# EAGLE design tank_interface (EAGLE 7.2.0)
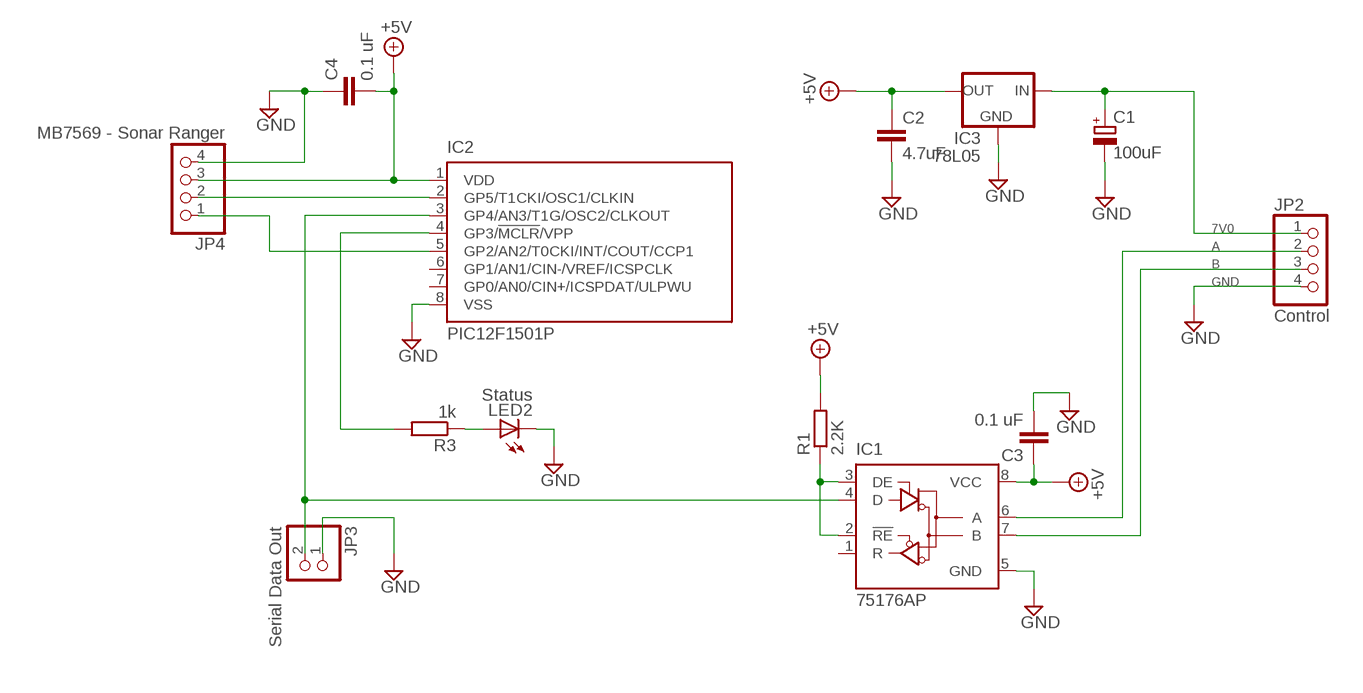
[diagram p0: schematic, sheet 1]

## Parts
C1  100uF  CPOL-EUE2.5-7  [E2,5-7]
C2  4.7uF  C-EUC0402  [C0402]
C3  0.1 uF  C-EUC0402  [C0402]
C4  0.1 uF  C-EUC0402  [C0402]
IC1  75176AP  [DIL08]
IC2  PIC12F1501P  PIC12F683P  [DIL8]
IC3  78L05  78XXS  [78XXS]
JP2  Control  PINHD-1X4  [1X04]
JP3  Serial Data Out  PINHD-1X2  [1X02]
JP4  MB7569 - Sonar Ranger  PINHD-1X4  [1X04]
LED2  Status  LED3MM  [LED3MM]
R1  2.2K  R-EU_R0603  [R0603]
R3  1k  R-EU_R0603  [R0603]

## Nets
7V0: C1.+ IC3.IN JP2.1
+5V: C2.1 C3.1 C4.2 IC1.8(VCC) IC2.1(VDD) IC3.OUT JP4.3 R1.2
A: IC1.6(A) JP2.2
B: IC1.7(B) JP2.3
DE: IC1.2(!RE) IC1.3(DE) R1.1
GND: C1.- C2.2 C3.2 C4.1 IC1.5(GND) IC2.8(VSS) IC3.GND JP2.4 JP3.1 JP4.4 LED2.K(C)
N$1: IC2.5(GP2/AN2/T0CKI/INT/COUT/CCP1) JP4.1
N$5: LED2.A R3.1
SDAT_IN: IC2.2(GP5/T1CKI/OSC1/CLKIN) JP4.2
SDAT_OUT: IC1.4(D) IC2.3(GP4/AN3/T1G/OSC2/CLKOUT) JP3.2
STATUS_LED: IC2.4(GP3/!MCLR!/VPP) R3.2
Unconnected: IC1.1(R) IC2.6(GP1/AN1/CIN-/VREF/ICSPCLK) IC2.7(GP0/AN0/CIN+/ICSPDAT/ULPWU)

## Library data of the parts
C1 = rcl:CPOL-EU: POLARIZED CAPACITOR, European symbol
C2-C4 = rcl:C-EU: CAPACITOR, European symbol
IC1 = 751xx:75176A: DIFFERENTIAL BUS TRANSCEIVER Source: http://focus.ti.com/lit/ds/symlink/sn75176a.pdf
IC2 = microchip:PIC12F683: 8-Pin Flash-Based, 8-Bit CMOS Microcontrollers with nanoWatt Technology Source: http://ww1.microchip.com/downloads/en/DeviceDoc/41211D_.pdf; MF: MICROCHIP; MPN: PIC12F683-I/P; OC_FARNELL: 9759034; OC_NEWARK: 89H0442
IC3 = v-reg:78XXS: VOLTAGE REGULATOR
JP2 JP4 = pinhead:PINHD-1X4: PIN HEADER
JP3 = pinhead:PINHD-1X2: PIN HEADER
LED2 = led:LED: LED OSRAM: - CHIPLED LG R971, LG N971, LY N971, LG Q971, LY Q971, LO R971, LY R971 LH N974, LH R974 LS Q976, LO Q976, LY Q976 LO Q996 - Hyper CHIPLED LW Q18S LB Q993, LB Q99A, LB R99A - SideLED LS A670, LO A670, LY A670, LG A670, LP A670 LB A673, LV A673, LT A673, LW A673 LH A674 LY A675 LS A676, LA A676, LO A676, LY A676, LW A676 LS A679, LY A679, LG A679 - Hyper Micro SIDELED® LS Y876, LA Y876, LO Y876, LY Y876 LT Y87S - SmartLED LW L88C, LW L88S LB L89C, LB L89S, LG L890 LS L89K, LO L89K, LY L89K LS L896, LA L896, LO L896, LY L896 - TOPLED LS T670, LO T670, LY T670, LG T670, LP T670 LSG T670, LSP T670, LSY T670, LOP T670, LYG T670 LG T671, LOG T671, LSG T671 LB T673, LV T673, LT T673, LW T673 LH T674 LS T676, LA T676, LO T676, LY T676, LB T676, LH T676, LSB T676, LW T676 LB T67C, LV T67C, LT T67C, LS T67K, LO T67K, LY T67K, LW E67C LS E67B, LA E67B, LO E67B, LY E67B, LB E67C, LV E67C, LT E67C LW T67C LS T679, LY T679, LG T679 LS T770, LO T770, LY T770, LG T770, LP T770 LB T773, LV T773, LT T773, LW T773 LH T774 LS E675, LA E675, LY E675, LS T675 LS T776, LA T776, LO T776, LY T776, LB T776 LHGB T686 LT T68C, LB T68C - Hyper Mini TOPLED® LB M676 - Mini TOPLED Santana® LG M470 LS M47K, LO M47K, LY M47K Source: http://www.osram.convergy.de LUXEON: - LUMILED® LXK2-PW12-R00, LXK2-PW12-S00, LXK2-PW14-U00, LXK2-PW14-V00 LXK2-PM12-R00, LXK2-PM12-S00, LXK2-PM14-U00 LXK2-PE12-Q00, LXK2-PE12-R00, LXK2-PE12-S00, LXK2-PE14-T00, LXK2-PE14-U00 LXK2-PB12-K00, LXK2-PB12-L00, LXK2-PB12-M00, LXK2-PB14-N00, LXK2-PB14-P00, LXK2-PB14-Q00 LXK2-PR12-L00, LXK2-PR12-M00, LXK2-PR14-Q00, LXK2-PR14-R00 LXK2-PD12-Q00, LXK2-PD12-R00, LXK2-PD12-S00 LXK2-PH12-R00, LXK2-PH12-S00 LXK2-PL12-P00, LXK2-PL12-Q00, LXK2-PL12-R00 Source: www.luxeon.com KINGBRIGHT: KA-3528ASYC Source: www.kingbright.com
R1 R3 = rcl:R-EU_: RESISTOR, European symbol

## Board
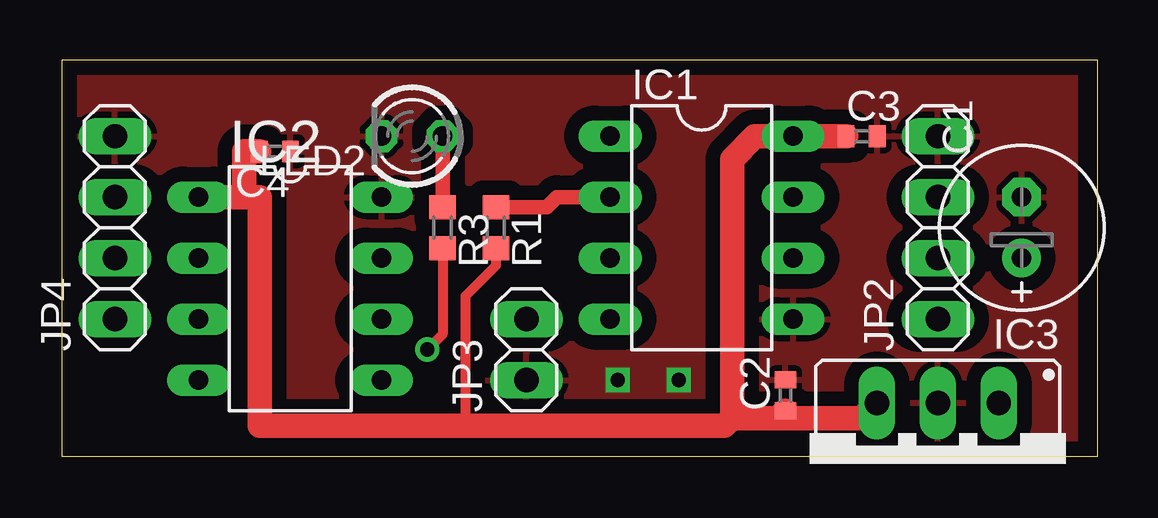
[diagram p1: board, top side]
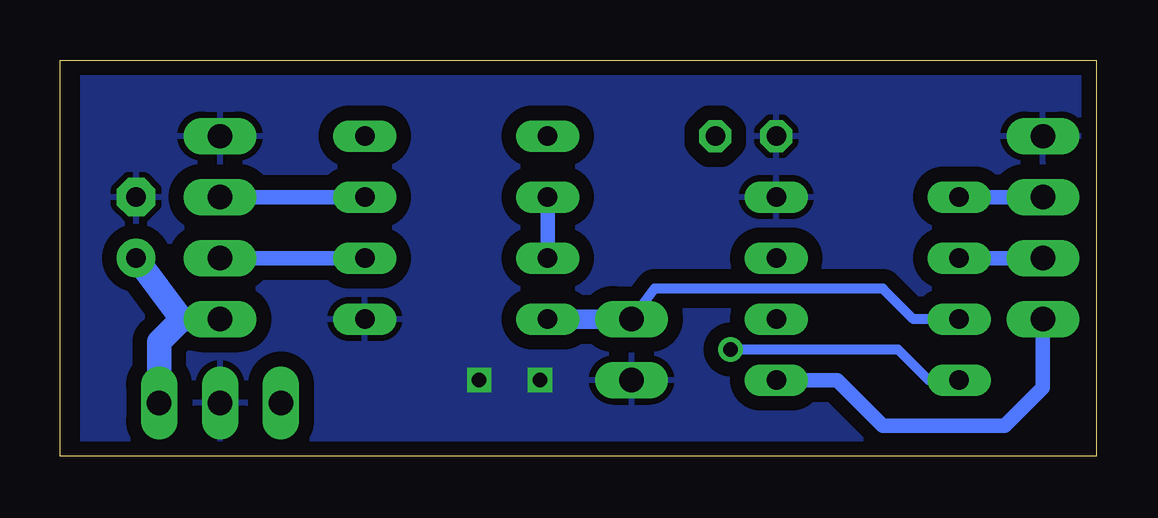
[diagram p2: board, bottom side, seen from below]

Size 43.18 x 16.51 mm. Coordinates in mm from the lower left corner, seen from the top.
Outline: 0,0 43.18,0 43.18,16.51 0,16.5 0,0
Copper layers (1*16): Top 0.035mm / dielectric 1.5mm / Bottom 0.035mm
Design rules "default *": minimum track width 10mil, minimum drill 20mil, track to track 8mil, track to pad 8mil, pad to pad 8mil, via to via 8mil, smd to smd 8mil, copper to edge 20mil, drill to drill 8mil, minimum pad ring 10mil, minimum via ring 8mil, stop-mask expansion 4mil, vias tented up to drill 0mil, thermal gap 10mil

### Footprints (pad centres in the part's own frame; a part is rotated, then mirrored left to right if it is on the bottom)
E2,5-7 = drill 0.813 pad 1.6: + -1.27,0 | drill 0.813 pad 1.6 octagon: - 1.27,0
C0402 = smd 0.7 x 0.9: 1 -0.65,0; 2 0.65,0
DIL08 = drill 0.813 long: 1 -3.81,-3.81; 2 -1.27,-3.81; 3 1.27,-3.81; 4 3.81,-3.81; 5 3.81,3.81; 6 1.27,3.81; 7 -1.27,3.81; 8 -3.81,3.81
DIL8 = drill 0.813 long: 1 -3.81,-3.81; 2 -1.27,-3.81; 3 1.27,-3.81; 4 3.81,-3.81; 5 3.81,3.81; 6 1.27,3.81; 7 -1.27,3.81; 8 -3.81,3.81
78XXS = drill 1.016 long: GND 0,-2.54; IN -2.54,-2.54; OUT 2.54,-2.54
1X04 = drill 1.016 long: 1 -3.81,0; 2 -1.27,0; 3 1.27,0; 4 3.81,0
1X02 = drill 1.016 long: 1 -1.27,0; 2 1.27,0
LED3MM = drill 0.813 octagon: A -1.27,0; K 1.27,0
R0603 = smd 1 x 1.1: 1 -0.85,0; 2 0.85,0

### Placement (x,y rotation side)
C1  40.01,9.53 90 top
C2  30.16,2.54 90 top
C3  33.34,13.34 0 top
C4  8.89,12.7 180 top
IC1  26.67,9.53 270 top
IC2  9.53,6.99 270 top
IC3  36.51,-0.32 180 top
JP2  36.51,9.53 90 top
JP3  19.37,4.45 90 top
JP4  2.22,9.53 90 top
LED2  14.61,13.34 180 top
R1  18.1,9.53 270 top
R3  15.88,9.53 270 top

### Tracks (layer width: path | path; a pad name or v marks a point on that pad's centre or on a via)
7V0
  Bottom 1.016: 38.1,5.71 JP2.1 35.56,5.71 | 38.1,5.71 C1.+ | IC3.IN 39.05,4.76 38.1,5.71
+5V
  Top 0.406: R1.2 18.1,7.94 16.83,6.67 16.83,1.27
  Top 1.016: 7.62,10.79 8.26,10.79 8.26,1.27 16.83,1.27 27.62,1.27 27.94,1.59 | 7.62,10.79 IC2.1 | IC1.8 C3.1 | IC1.8 31.11,13.34 | C4.2 7.62,12.7 7.62,10.79 | IC1.8 28.89,13.34 27.94,12.38 27.94,1.59 | 27.94,1.59 29.84,1.59 | 29.84,1.59 33.34,1.59 IC3.OUT | C2.1 30.15,1.89 29.84,1.59
  Bottom 0.61: JP4.3 IC2.1
A
  Bottom 0.61: IC1.6 JP2.2
B
  Bottom 0.61: IC1.7 JP2.3
DE
  Top 0.61: R1.1 20.22,10.38 20.64,10.79 IC1.2
  Bottom 0.61: IC1.2 IC1.3
GND  (via drill 0.6)
  other vias: 23.18,3.17 25.72,3.17
  pour Top (isolate 0.61): 0.64,15.88 42.23,15.88 42.23,0.64 0.64,0.64
  pour Bottom (isolate 0.61): 0.64,15.88 42.23,15.88 42.23,0.64 0.64,0.64
N$1
  Bottom 0.61: IC2.5 10.79,3.17 8.89,1.27 3.81,1.27 2.22,2.86 JP4.1
N$5
  Top 0.61: LED2.A R3.1
SDAT_IN
  Bottom 0.61: JP4.2 IC2.2
SDAT_OUT
  Bottom 0.406: IC2.3 7.62,5.71 8.89,6.99 18.41,6.99 JP3.2
  Bottom 0.813: IC1.4 JP3.2
STATUS_LED  (via drill 0.6)
  Top 0.406: R3.2 15.88,5.08 v15.24,4.45
  Bottom 0.406: IC2.4 6.99,3.17 8.26,4.45 v15.24,4.45